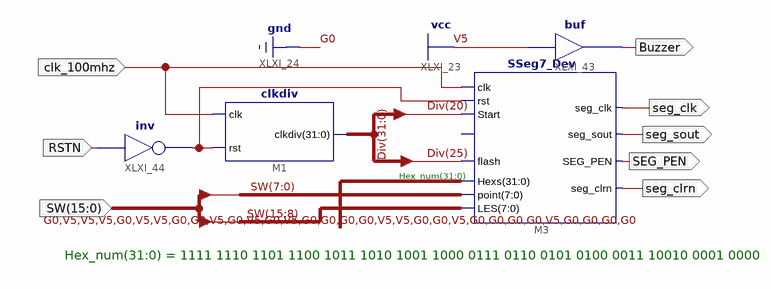
[diagram p0: schematic sheet 1]
// Xilinx ISE schematic Top_Hex8T7SEG.sch (kintex7) as structural Verilog: 4 symbols, 8 ports
module Top_Hex8T7SEG (
  input  [15:0] SW,
  input  clk_100mhz,
  input  RSTN,
  output seg_clk,
  output seg_sout,
  output SEG_PEN,
  output seg_clrn,
  output Buzzer
);

  wire XLXN_502;
  wire [31:0] Div;

  SSeg7_Dev M3 (
    .LES(SW[15:8]), .SEG_PEN(SEG_PEN), .seg_sout(seg_sout), .seg_clrn(seg_clrn), .point(SW[7:0]),
    .Hexs(32'b01110110010101000011001000010000), .flash(Div[25]), .seg_clk(seg_clk), .clk(clk_100mhz),
    .rst(XLXN_502), .Start(Div[20]));  // open: SW0
  not XLXI_44 (XLXN_502, RSTN);
  clkdiv #(.VeriModel("clkdiv")) M1 (.clk(clk_100mhz), .rst(XLXN_502), .clkdiv(Div));
  buf XLXI_43 (Buzzer, 1'b1);

  // Notes on the sheet:
  //   Hex_num(31:0)
  //   Hex_num(31:0) = 1111 1110 1101 1100 1011 1010 1001 1000 0111 0110 0101 0100 0011 10010 0001 0000
endmodule
